# EasyEDA schematic PCB_Schematic_Layout.json
TITLE: Sheet_1; REV: 1.0; Date: 2026-07-27; Sheet: 1/1; Drawn By: cloudeonmcyt; Company: Your Company
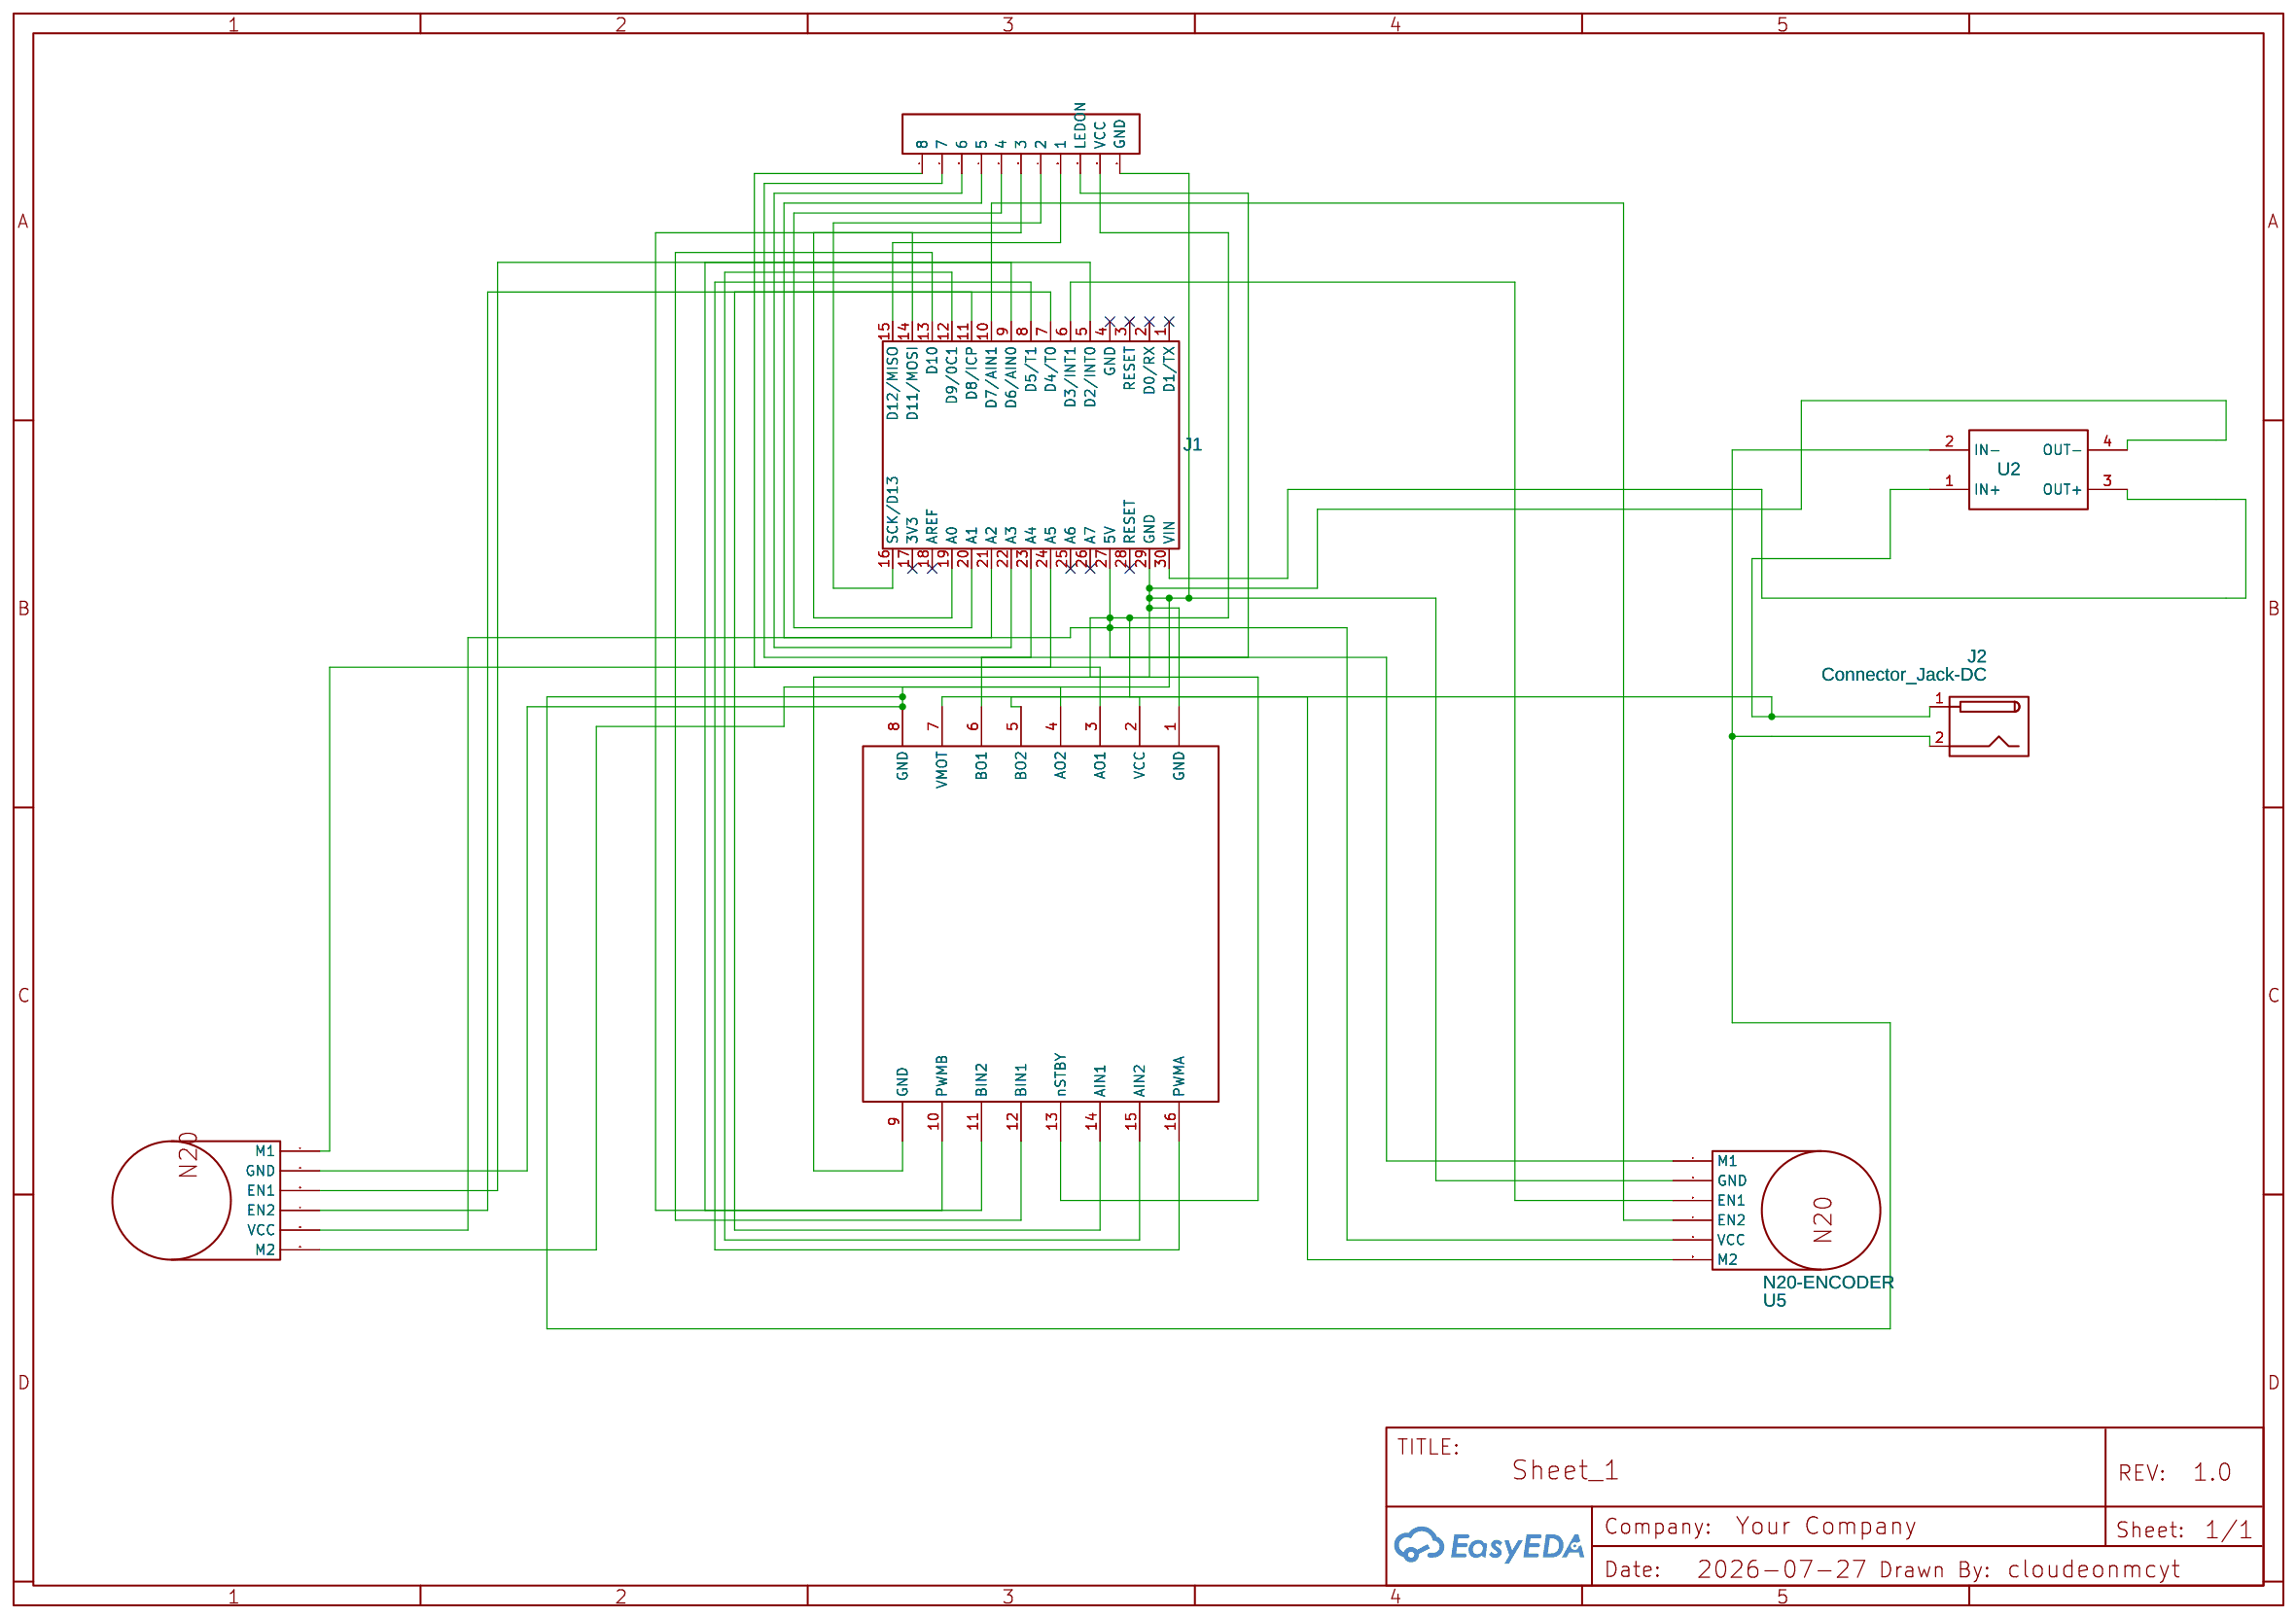
[diagram p0: schematic sheet]

## Parts
J1  Arduino_Nano_Header  [DIP-30_L43.18-W15.24-ARDUINONANO]
J2  Connector_Jack-DC  [CONNECTOR_BARRELJACK:BARRELJACK_WUERTH_6941XX301002]
P1  Header-Female-2.54_1x11  [HEADER-FEMALE-2.54_1X11]
U1  TB6612FNG Dual Motor Driver Carrier  [TB6612FNG DUAL MOTOR DRIVER CARRIER]
U2  MP1584EN  [MP1584EN]
U5  N20-ENCODER  [N20-ENCODER]
U6  N20-ENCODER  [N20-ENCODER]

## Library data of the parts
J1 = Arduino_Nano_Header
J2 = Connector_Jack-DC: Add into BOM: yes; Convert to PCB: yes; Origin Footprint: Connector_BarrelJack:BarrelJack_Wuerth_6941xx301002; Contributor: t.teenoom
P1 = Header-Female-2.54_1x11: Supplier Part: undefined; Contributor: lovely95
U1 = TB6612FNG Dual Motor Driver Carrier: Contributor: winter2015; sourceId: YsmgyP7pj
U2 = MP1584EN: Contributor: ideiters
U5 U6 = N20-ENCODER: Contributor: traynin.sci

## Nets
Net-(J1-5): J1.5(D2/INT0) U6.3(EN1)
Net-(J1-6): J1.6(D3/INT1) U5.3(EN1)
Net-(J1-7): J1.7(D4/T0) U6.4(EN2)
Net-(J1-8): J1.8(D5/T1) U1.16(PWMA)
Net-(J1-9): J1.9(D6/AIN0) U1.10(PWMB)
Net-(J1-10): J1.10(D7/AIN1) U5.4(EN2)
Net-(J1-11): J1.11(D8/ICP) U1.14(AIN1)
Net-(J1-12): J1.12(D9/0C1) U1.15(AIN2)
Net-(J1-13): J1.13(D10) U1.12(BIN1)
Net-(J1-14): J1.14(D11/MOSI) U1.11(BIN2)
Net-(J1-15): J1.15(D12/MISO) P1.8(1)
Net-(J1-16): J1.16(SCK/D13) P1.7(2)
Net-(J1-19): J1.19(A0) P1.6(3)
Net-(J1-20): J1.20(A1) P1.5(4)
Net-(J1-21): J1.21(A2) P1.4(5)
Net-(J1-22): J1.22(A3) P1.3(6)
Net-(J1-23): J1.23(A4) P1.2(7)
Net-(J1-24): J1.24(A5) P1.1(8)
Net-(J1-27): J1.27(5V) P1.9(LEDON) P1.10(VCC) U1.2(VCC) U1.13(nSTBY) U5.5(VCC) U6.5(VCC)
Net-(J1-29): J1.29(GND) J2.2 P1.11(GND) U1.1(GND) U1.8(GND) U1.9(GND) U2.2(IN-) U2.4(OUT-) U5.2(GND) U6.2(GND)
Net-(J1-30): J1.30(VIN) U2.3(OUT+)
Net-(J2-1): J2.1 U1.7(VMOT) U2.1(IN+)
Net-(U1-3): U1.3(AO1) U6.1(M1)
Net-(U1-4): U1.4(AO2) U6.6(M2)
Net-(U1-5): U1.5(BO2) U5.6(M2)
Net-(U1-6): U1.6(BO1) U5.1(M1)

Not connected (* = marked no-connect by the designer): J1 1(D1/TX)* 2(D0/RX)* 3(RESET)* 4(GND)* 17(3V3)* 18(AREF)* 25(A6)* 26(A7)* 28(RESET)*
